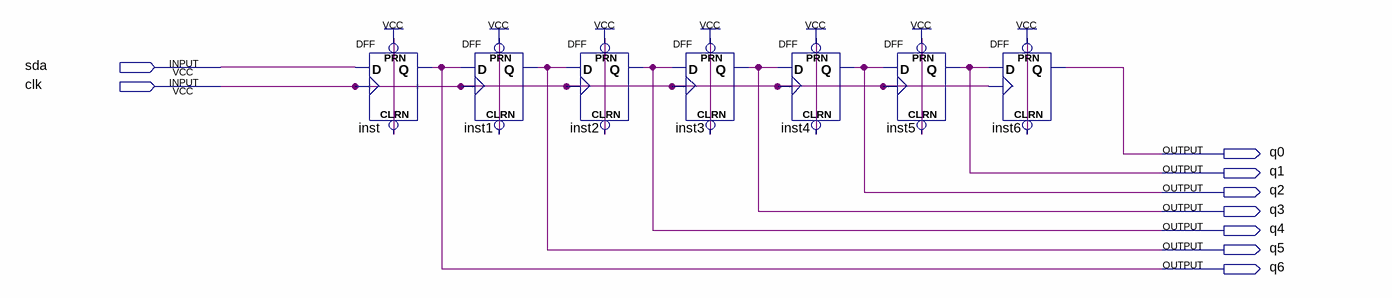
[diagram p0: schematic sheet]
// Quartus schematic regsp7b.bdf as structural Verilog: 7 symbols, 9 pins
module regsp7b (
  input  sda,
  input  clk,
  output q0,
  output q1,
  output q2,
  output q3,
  output q4,
  output q5,
  output q6
);

  DFF inst (.CLRN(1'b1), .CLK(clk), .D(sda), .PRN(1'b1), .Q(q6));
  DFF inst1 (.CLRN(1'b1), .CLK(clk), .D(q6), .PRN(1'b1), .Q(q5));
  DFF inst2 (.CLRN(1'b1), .CLK(clk), .D(q5), .PRN(1'b1), .Q(q4));
  DFF inst3 (.CLRN(1'b1), .CLK(clk), .D(q4), .PRN(1'b1), .Q(q3));
  DFF inst4 (.CLRN(1'b1), .CLK(clk), .D(q3), .PRN(1'b1), .Q(q2));
  DFF inst5 (.CLRN(1'b1), .CLK(clk), .D(q2), .PRN(1'b1), .Q(q1));
  DFF inst6 (.CLRN(1'b1), .CLK(clk), .D(q1), .PRN(1'b1), .Q(q0));
endmodule
